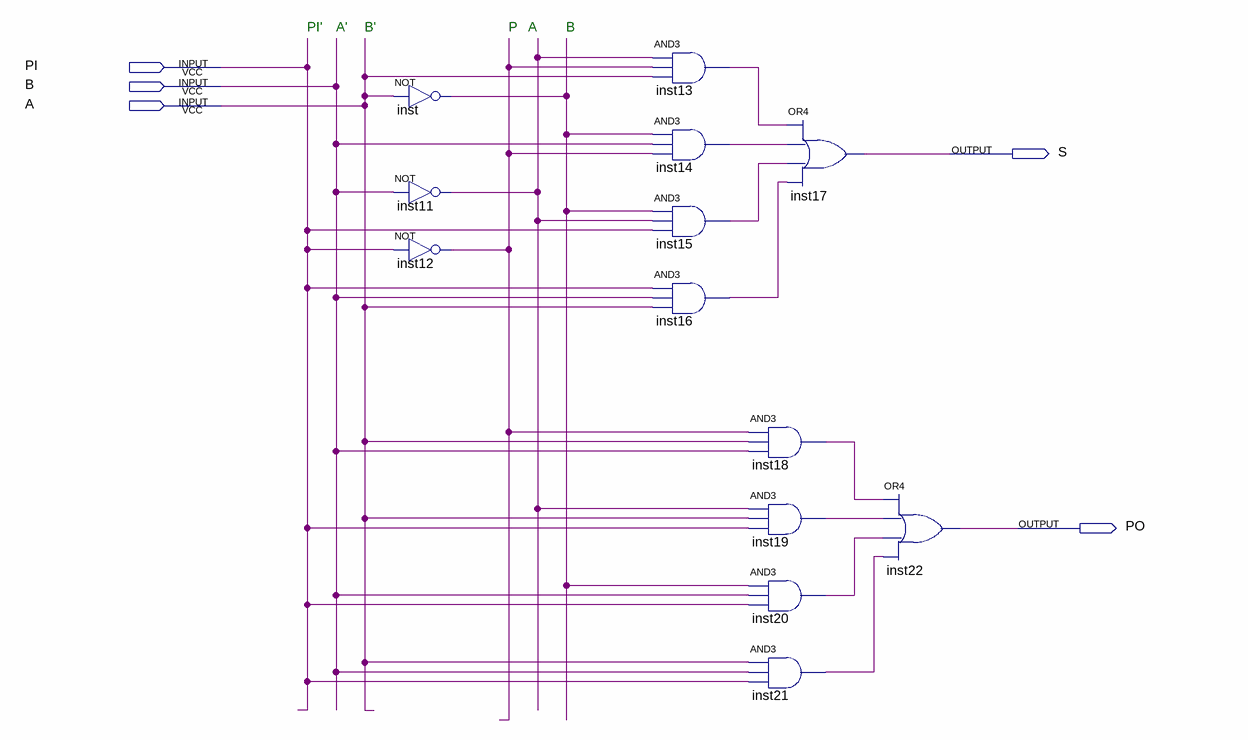
[diagram p0: schematic sheet]
// Quartus schematic cmb5.bdf as structural Verilog: 13 symbols, 5 pins
module cmb5 (
  input  PI,
  input  B,
  input  A,
  output S,
  output PO
);

  wire inst11_out, inst12_out, inst13_out, inst14_out, inst15_out, inst16_out, inst18_out, inst19_out,
       inst20_out, inst21_out, inst_out;

  not inst (inst_out, A);
  not inst11 (inst11_out, B);
  not inst12 (inst12_out, PI);
  and inst13 (inst13_out, inst11_out, inst12_out, A);
  and inst14 (inst14_out, inst_out, B, inst12_out);
  and inst15 (inst15_out, inst_out, inst11_out, PI);
  and inst16 (inst16_out, PI, B, A);
  and inst18 (inst18_out, inst12_out, A, B);
  and inst19 (inst19_out, inst11_out, A, PI);
  and inst20 (inst20_out, inst_out, B, PI);
  and inst21 (inst21_out, A, B, PI);
  or inst17 (S, inst13_out, inst14_out, inst15_out, inst16_out);
  or inst22 (PO, inst18_out, inst19_out, inst20_out, inst21_out);

  // Notes on the sheet:
  //   PI'
  //   A'
  //   B'
  //   P
  //   A
  //   B
endmodule
